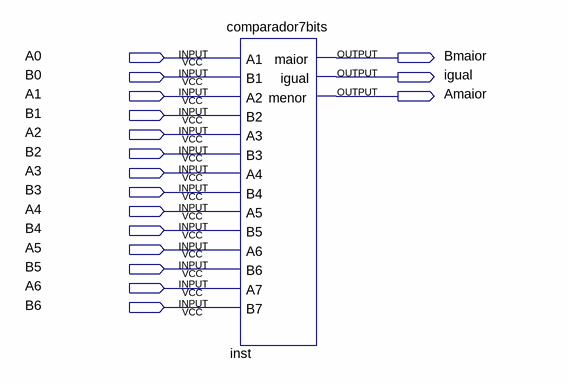
[diagram p0: schematic sheet]
// Quartus schematic comparador8Bits.bdf as structural Verilog: 1 symbols, 17 pins
module comparador8Bits (
  input  A0,
  input  B0,
  input  A1,
  input  B1,
  input  A2,
  input  B2,
  input  A3,
  input  B3,
  input  A4,
  input  B4,
  input  A5,
  input  B5,
  input  A6,
  input  B6,
  output Bmaior,
  output igual,
  output Amaior
);

  comparador7bits inst (
    .A1(A0), .B1(B0), .A2(A1), .B2(B1), .A3(A2), .B3(B2), .A4(A3), .B4(B3), .A5(A4), .B5(B4), .A6(A5),
    .B6(B5), .A7(A6), .B7(B6), .maior(Bmaior), .igual(igual), .menor(Amaior));
endmodule
